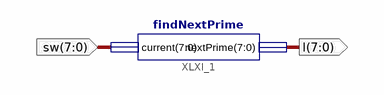
[diagram p0: schematic sheet 1]
// Xilinx ISE schematic top.sch (spartan6) as structural Verilog: 1 symbols, 2 ports
module top (
  input  [7:0] sw,
  output [7:0] l
);

  findNextPrime XLXI_1 (.current(sw), .nextPrime(l));
endmodule
